# EAGLE design Module_T+H_01v (EAGLE 7.7.0)
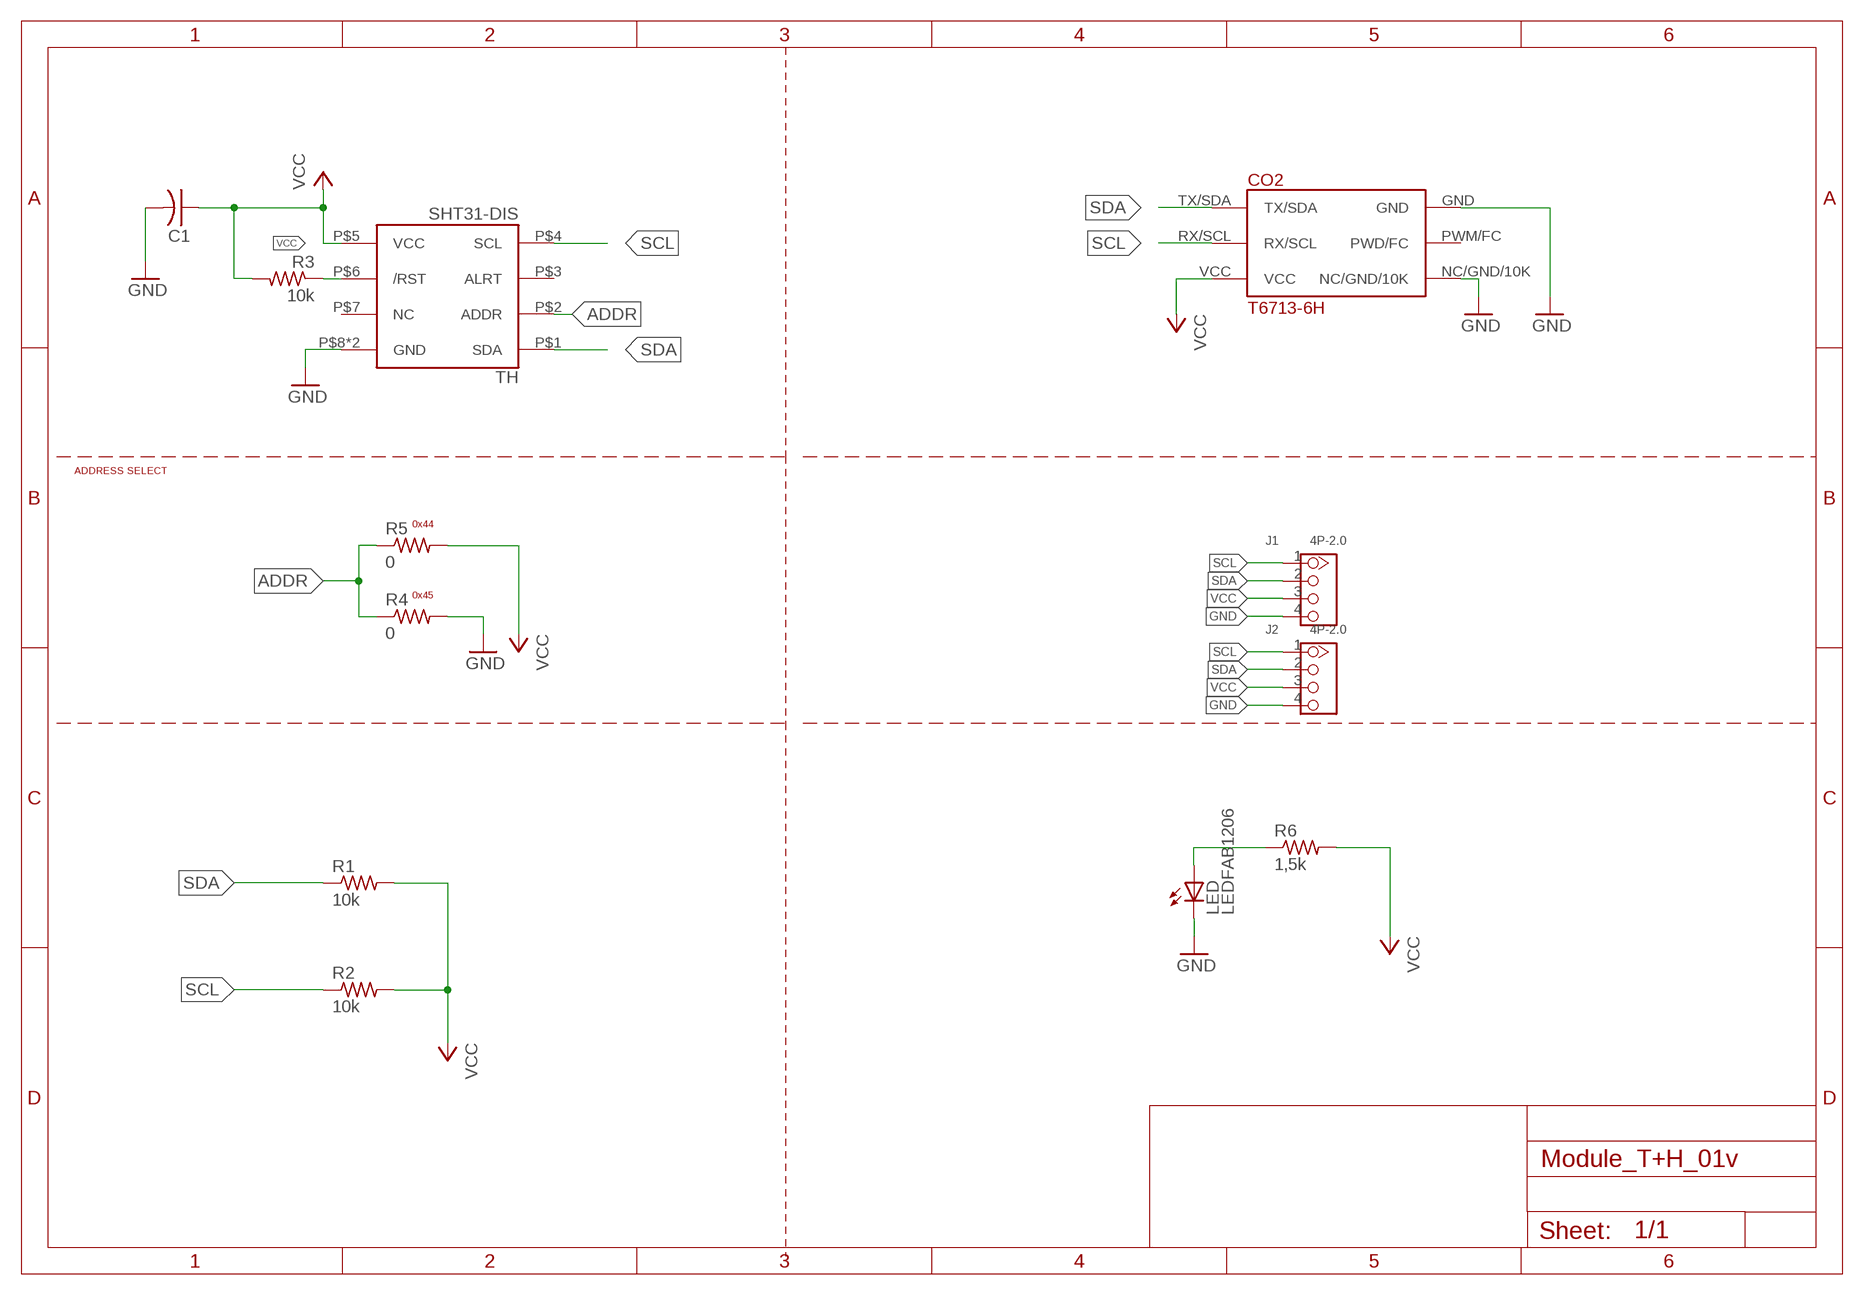
[diagram p0: schematic, sheet 1]

## Parts
C1  CAP-US1206FAB  [C1206FAB]
CO2  T6713-6H  [PINS]
J1  4P-2.0  GROVE-CONNECTOR-DIP(4P-2.0)  [HW4-2.0]
J2  4P-2.0  GROVE-CONNECTOR-DIP(4P-2.0)  [HW4-2.0]
LED  LEDFAB1206  [LED1206FAB]
R1  10k  RES-US1206FAB  [R1206FAB]
R2  10k  RES-US1206FAB  [R1206FAB]
R3  10k  RES-US1206FAB  [R1206FAB]
R4  0  RES-US1206FAB  [R1206FAB]
R5  0  RES-US1206FAB  [R1206FAB]
R6  1,5k  RES-US1206FAB  [R1206FAB]
TH  SHT31-DIS  [SHT3X]

## Nets
ADDR: R4.1 R5.1 TH.P$2(ADDR)
GND: C1.2 CO2.GND CO2.NC/GND/10K J1.4 J2.4 LED.2(C) R4.2 TH.P$8(GND) TH.PAD(GND)
N$1: LED.1(A) R6.1
RST: R3.1 TH.P$6(/RST)
SCL: CO2.RX/SCL J1.1 J2.1 R2.1 TH.P$4(SCL)
SDA: CO2.TX/SDA J1.2 J2.2 R1.1 TH.P$1(SDA)
VCC: C1.1 CO2.VCC J1.3 J2.3 R1.2 R2.2 R3.2 R5.2 R6.2 TH.P$5(VCC)
Unconnected: CO2.PWM/FC(PWD/FC) TH.P$3(ALRT) TH.P$7(NC)

## Notes on the sheet
- ADDRESS SELECT
- 0x44
- 0x45

## Library data of the parts
C1 = fab_2:CAP-US
CO2 = T6713-6H:T6713-6H
J1 J2 = Seeed-OPL-Connector:GROVE-CONNECTOR-DIP(4P-2.0): 320110033
LED = fab_2:LED: LED
R1-R6 = fab:RES-US: Resistor (US Symbol) Variants with postfix FAB are widened to allow the routing of internal traces
TH = thomasb9511:SHT31-DIS

## Board
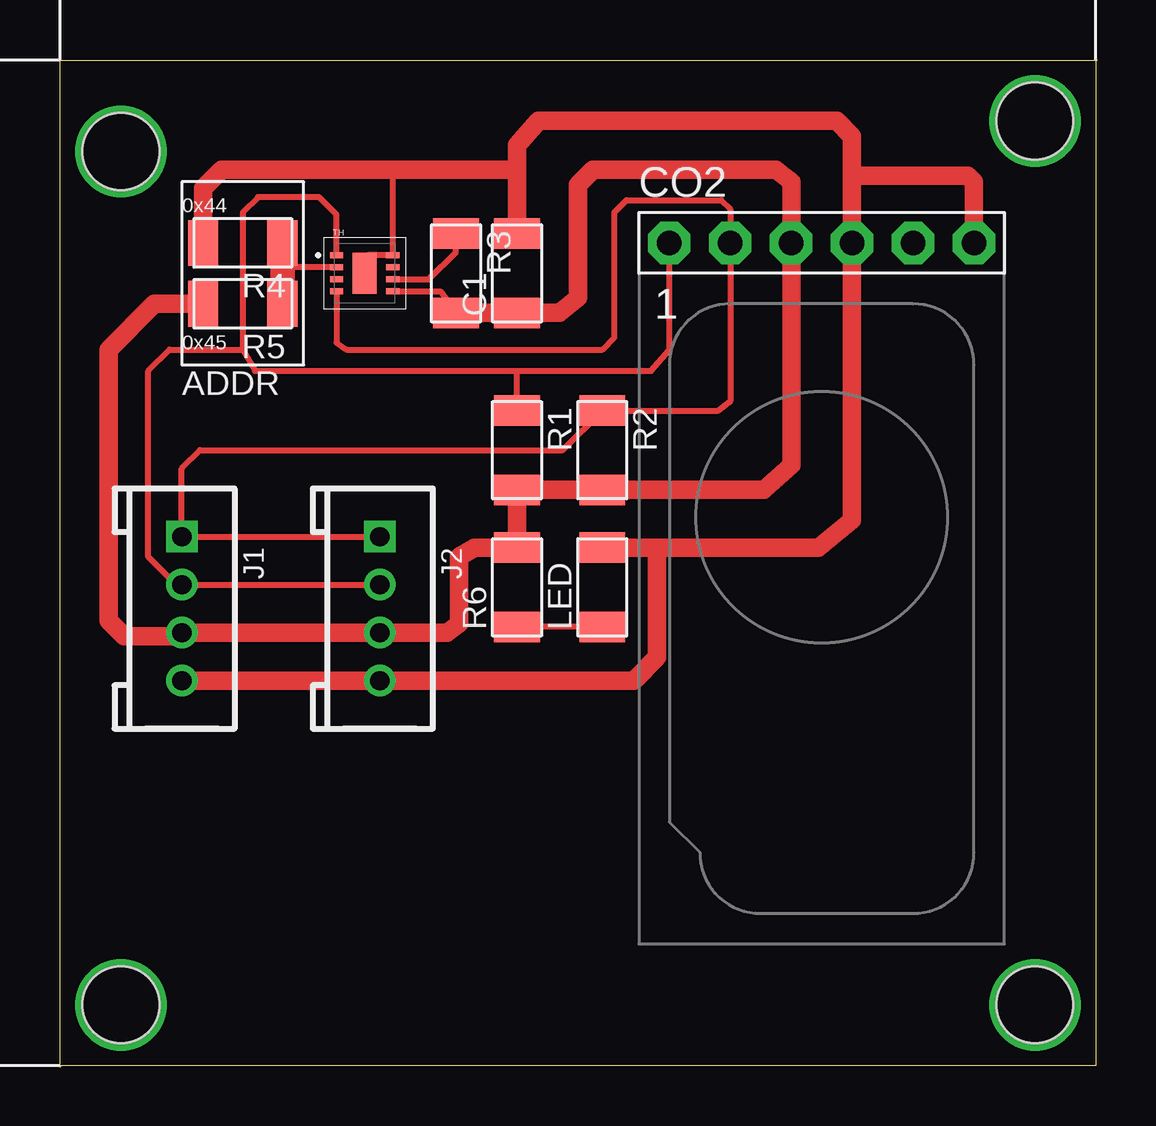
[diagram p1: board, top side]

Size 43.18 x 41.91 mm. Coordinates in mm from the lower left corner, seen from the top.
Outline: 0,0 0,41.91 43.18,41.91 43.18,0 0,0
Copper layers (1*16): Top 0.035mm / dielectric 1.5mm / Bottom 0.035mm
Design rules "default": minimum track width 10mil, minimum drill 24mil, track to track 8mil, track to pad 8mil, pad to pad 8mil, via to via 8mil, smd to smd 8mil, copper to edge 40mil, drill to drill 8mil, minimum pad ring 10mil, minimum via ring 8mil, stop-mask expansion 4mil, vias tented up to drill 0mil, thermal gap 10mil
Holes 3.2 mm at 40.64,39.37 2.54,38.1 2.54,2.54 40.64,2.54

### Footprints (pad centres in the part's own frame; a part is rotated, then mirrored left to right if it is on the bottom)
C1206FAB = smd 1.27 x 1.905: 1 -1.651,0; 2 1.651,0
PINS = drill 1.016 pad 1.778 octagon: GND 1.27,0; NC/GND/10K 6.35,0; PWM/FC 3.81,0; RX/SCL -3.81,0; TX/SDA -6.35,0; VCC -1.27,0
HW4-2.0 = drill 0.8 pad 1.27 square: 1 -3,0 | drill 0.8 pad 1.27: 2 -1,0; 3 1,0; 4 3,0
LED1206FAB = smd 1.27 x 1.905: 1 -1.651,0; 2 1.651,0
R1206FAB = smd 1.27 x 1.905: 1 -1.651,0; 2 1.651,0
SHT3X = smd 0.55 x 0.25: P$1 -1.175,0.75; P$2 -1.175,0.25; P$3 -1.175,-0.25; P$4 -1.175,-0.75; P$5 1.175,-0.75; P$6 1.175,-0.25; P$7 1.175,0.25; P$8 1.175,0.75 | smd 1 x 1.7: PAD 0,0

### Placement (x,y rotation side)
C1  19.05,33.02 90 top
CO2  31.75,34.29 0 top
J1  5.08,19.05 270 top
J2  13.34,19.05 270 top
LED  22.61,19.94 90 top
R1  19.05,25.65 270 top
R2  22.61,25.65 270 top
R3  16.51,33.02 270 top
R4  7.62,34.29 180 top
R5  7.62,31.75 180 top
R6  19.05,19.94 90 top
TH  12.7,33.02 0 top

### Tracks (layer width: path | path; a pad name or v marks a point on that pad's centre or on a via)
ADDR
  Top 0.254: TH.P$2 9.52,33.27 9.27,33.02
  Top 1.016: R5.1 9.27,33.02 R4.1
GND
  Top 0.254: 12.7,33.66 12.81,33.77 TH.P$8 13.88,37.31
  Top 0.305: 12.7,33.66 TH.PAD | 13.88,37.31 13.84,37.34
  Top 0.762: R4.2 5.97,36.58 6.73,37.34 13.84,37.34 19.05,37.34 | 19.05,37.34 19.05,38.35 19.94,39.37 32.38,39.37 33.02,38.73 33.02,37.08 | C1.2 19.05,37.34 | 33.02,37.08 CO2.GND 33.02,22.73 31.62,21.59 24.89,21.59 | CO2.NC/GND/10K 38.1,36.83 37.85,37.08 33.02,37.08 | J1.4 J2.4 23.92,16.05 24.89,17.02 24.89,21.59 | LED.2 24.89,21.59
N$1
  Top 0.254: LED.1 R6.1
N$2  (via drill 2.8 pad 0.3)
  other vias: 2.54,38.1
N$3  (via drill 2.8 pad 0.3)
  other vias: 40.64,39.37
N$4  (via drill 2.8 pad 0.3)
  other vias: 2.54,2.54
N$5  (via drill 2.8 pad 0.3)
  other vias: 40.64,2.54
RST
  Top 0.254: TH.P$6 15.37,32.77 16.51,33.91 R3.1
SCL
  Top 0.254: TH.P$4 11.53,30.13 11.94,29.84 22.61,29.84 23.11,30.35 23.11,35.56 23.62,36.07 27.56,36.07 27.94,35.69 CO2.RX/SCL 27.94,27.69 27.43,27.3 R2.1 20.95,25.65 5.84,25.65 5.08,24.89 J1.1 J2.1
SDA
  Top 0.254: TH.P$1 11.53,35.47 10.79,36.2 8.26,36.2 7.62,35.56 7.62,29.84 | 7.62,29.84 8.13,28.96 19.05,28.96 | 19.05,28.96 24.64,28.96 25.4,29.84 CO2.TX/SDA | R1.1 19.05,28.96 | 7.62,29.84 4.57,29.84 3.68,28.96 3.68,21.21 4.84,20.05 J1.2 J2.2
VCC
  Top 0.254: TH.P$5 15.86,32.27 R3.2 | 18.8,31.37 C1.1
  Top 0.762: 16.38,31.37 R3.2 18.8,31.37 | R5.2 3.94,31.75 2.03,29.84 2.03,18.54 2.67,17.91 4.94,17.91 J1.3 J2.3 16.14,18.05 16.64,18.41 16.64,21.21 17.27,21.59 R6.2 R1.2 R2.2 29.34,24 30.48,25.02 CO2.VCC 30.48,36.83 29.84,37.34 22.23,37.34 21.59,36.7 21.59,32 20.83,31.37 C1.1

### Text on the board
tPlace: 0x44 | 0x45 | ADDR